# Altium project op.PrjPCB
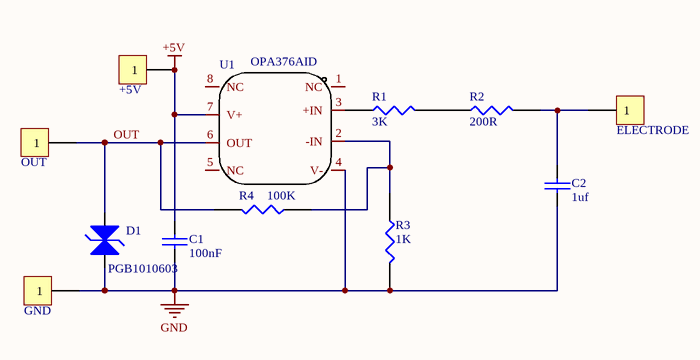
[diagram p0: op.SchDoc]
1 sheet, 12 parts. Net scope: global (net labels, ports and power ports of the same name join across sheets).
Board file: op.PcbDoc

## Sheet op.SchDoc
size A2

### Parts
+5V  OUT  [P]  (value not drawn)
C1  100nF  [0603]
C2  1uf  [0603]
D1  PGB1010603  [0603]
ELECTRODE  ELECTRODE  [T]  (value not drawn)
GND  GND  [P]  (value not drawn)
OUT  OUT  [P]  (value not drawn)
R1  3K  [0603]
R2  200R  [0603]
R3  1K  [0603]
R4  100K  [0603]
U1  OPA376AID  [SOIC-8]

### Nets
+5V: +5V.1 C1.1 U1.7(V+)
GND: C1.2 C2.2 D1.2 GND.1 R3.2 U1.4(V-)
OUT: D1.1 OUT.1 R4.2 U1.6(OUT)
NetC2_1: C2.1 ELECTRODE.1 R2.2
NetR1_1: R1.1 U1.3(+IN)
NetR1_2: R1.2 R2.1
NetR3_1: R3.1 R4.1 U1.2(-IN)

Not connected (* = marked no-connect by the designer): U1 1(NC) 5(NC) 8(NC)

### Library data of the parts
+5V ELECTRODE GND OUT = CON1: Connector
C1 C2 = CAP: Capacitor
D1 = DIODE
R1-R4 = RES1
U1 = 376